# EAGLE design pm2016 (EAGLE 6.0)
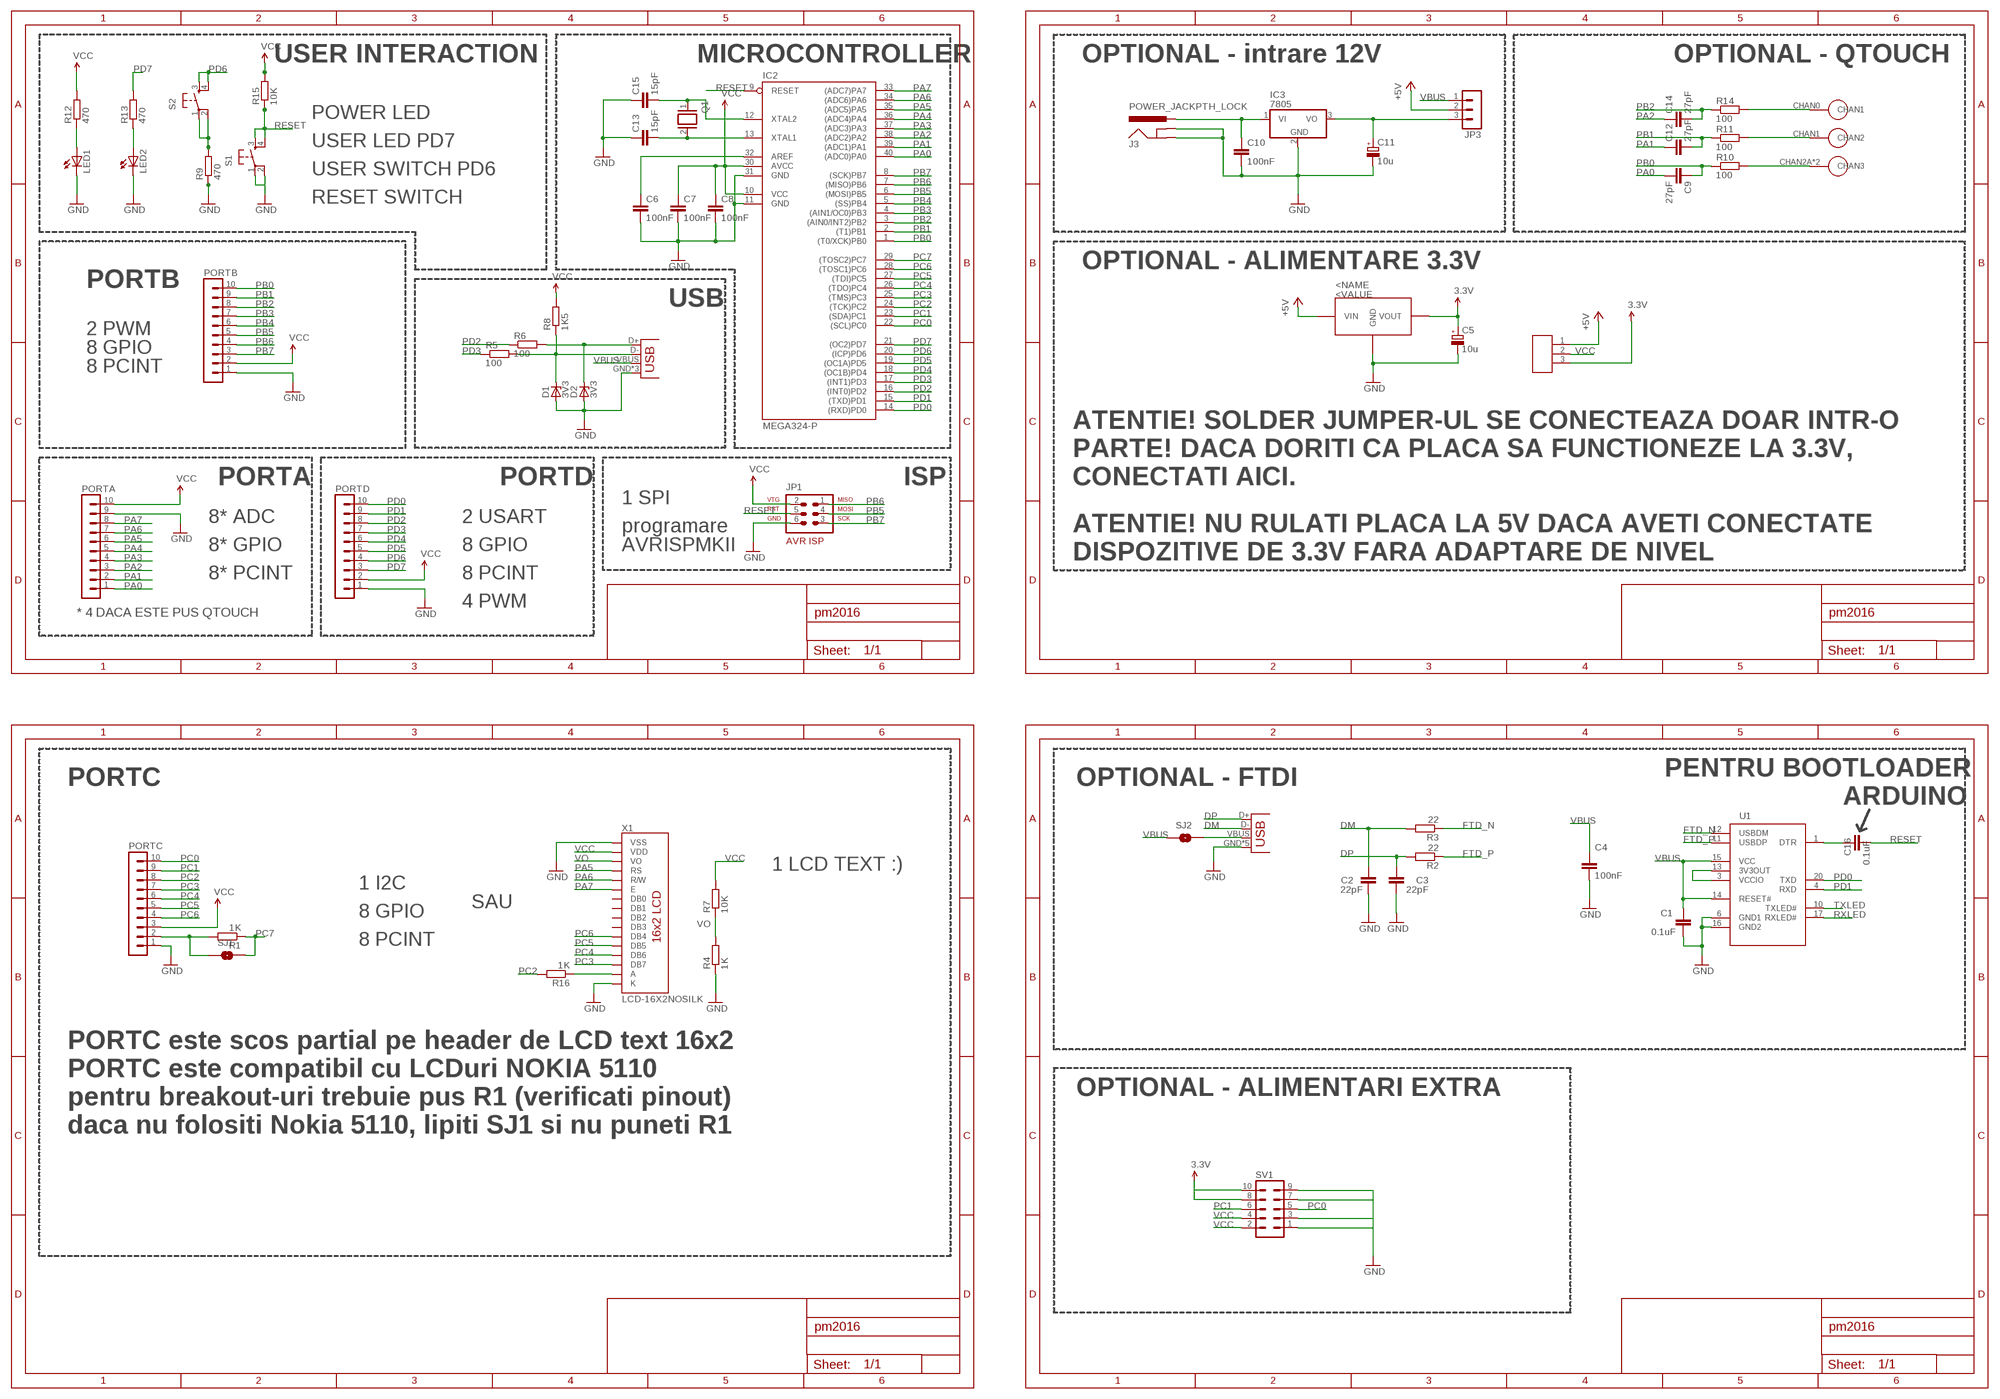
[diagram p0: schematic, sheet 1]

## Parts
C1  0.1uF  C-EUC0603  [C0603]
C2  22pF  C-EUC0603  [C0603]
C3  22pF  C-EUC0603  [C0603]
C4  100nF  C-EUC0603  [C0603]
C5  10u  CPOL-EUE2.5-5  [E2,5-5]
C6  100nF  C-EUC_PM  [C025-025X050]
C7  100nF  C-EUC_PM  [C025-025X050]
C8  100nF  C-EUC_PM  [C025-025X050]
C9  27pF  C-EUC1206  [C1206]
C10  100nF  C-EU025-025X050  [C025-025X050@1]
C11  10u  CPOL-EUE2.5-5  [E2,5-5]
C12  27pF  C-EUC1206  [C1206]
C13  15pF  C-EUC_PM  [C025-025X050]
C14  27pF  C-EUC1206  [C1206]
C15  15pF  C-EUC_PM  [C025-025X050]
C16  0.1uF  C-EUC0603  [C0603]
D1  3V3  ZENER-DIODEDO34-7  [DO34Z7]
D2  3V3  ZENER-DIODEDO34-7  [DO34Z7]
IC1  LE33  [TO92]
IC2  MEGA324-P  MEGA16-P  [DIL40]
IC3  7805  7805TNH  [TO22H_NOHOLE]
J1  USB  [ZX62D-B-5PA8]
J2  USBPTH  [USB-B-PTH]
J3  POWER_JACKPTH_LOCK  [POWER_JACK_PTH_LOCK]
JP1  AVR-ISP-6  [AVR-ISP-6]
JP2  SJUMPER  [SJUMPER_PACK]
JP3  MA03-1  [MA03-1]
LED1  LED5MM  [LED5MM]
LED2  LED5MM  [LED5MM]
PORTA  MA10-1  [MA10-1]
PORTB  MA10-1  [MA10-1]
PORTC  MA10-1  [MA10-1]
PORTD  MA10-1  [MA10-1]
Q1  XTAL/S  [QS]
R1  1K  R-EU_0204/7  [0204/7]
R2  22  R-EU_R0603  [R0603]
R3  22  R-EU_R0603  [R0603]
R4  1K  R-EU_0204/7  [0204/7]
R5  100  R-EU_0204/7  [0204/7]
R6  100  R-EU_0204/7  [0204/7]
R7  10K  R-EU_0204/7  [0204/7]
R8  1K5  R-EU_0204/7  [0204/7]
R9  470  R-EU_0204/7  [0204/7]
R10  100  R-EU_M1206  [M1206]
R11  100  R-EU_M1206  [M1206]
R12  470  R-EU_0204/7  [0204/7]
R13  470  R-EU_0204/7  [0204/7]
R14  100  R-EU_M1206  [M1206]
R15  10K  R-EU_0204/7  [0204/7]
R16  1K  R-EU_0204/7  [0204/7]
S1  TAC_SWITCHPTH  [TACTILE-PTH]
S2  TAC_SWITCHPTH  [TACTILE-PTH]
SJ1  SOLDERJUMPERNC  [SJ-NC]
SJ2  SOLDERJUMPERNC  [SJ-NC]
SV1  MA05-2  [MA05-2]
U1  FT231XS  [SSOP20]
U$1  QT_SLIDER  [QT_SLIDER]
X1  LCD-16X2NOSILK  [LCD-16X2_NOSILK]

## Nets
3.3V: C5.+ IC1.1(VOUT) JP2.3 SV1.8 SV1.10
+5V: IC1.3(VIN) JP2.1 JP3.2
DM: C2.2 J1.D- R3.2
DP: C3.2 J1.D+ R2.2
FTD_N: R3.1 U1.12(USBDM)
FTD_P: R2.1 U1.11(USBDP)
GND: C1.2 C2.1 C3.1 C4.2 C5.- C6.2 C7.2 C8.2 C10.2 C11.- C13.1 C15.1 D1.A D2.A IC1.2(GND) IC2.11(GND) IC2.31(GND) IC3.2(GND) J1.GND J1.P$8(GND) J1.P$9(GND) J1.P$10(GND) J1.P$11(GND) J2.GND J2.P$1(GND) J2.P$2(GND) J3.GND J3.GNDBREAK JP1.6 LED1.K(C) LED2.K(C) PORTA.9 PORTB.1 PORTC.1 PORTD.1 R4.1 R9.1 S1.1 S1.2 SV1.1 SV1.3 SV1.7 SV1.9 U1.6(GND1) U1.16(GND2) X1.1(VSS) X1.16(K)
N$1: LED2.A R13.1
N$2: LED1.A R12.1
N$3: PORTC.2 R1.2 SJ1.1
N$4: J1.VBUS SJ2.2
N$5: R14.2 U$1.CHAN0(CHAN1)
N$6: R11.2 U$1.CHAN1(CHAN2)
N$7: R10.2 U$1.CHAN2A(CHAN3) U$1.CHAN2B(CHAN3)
N$8: R16.1 X1.15(A)
N$9: C16.1 U1.1(DTR)
N$10: U1.3(VCCIO) U1.13(3V3OUT)
N$14: D2.C J2.D+ R6.2
N$15: D1.C J2.D- R5.2 R8.1
N$16: C10.1 IC3.1(VI) J3.PWR
N$17: R9.2 S2.1 S2.2
N$18: C11.+ IC3.3(VO) JP3.3
N$20: C6.1 IC2.32(AREF)
N$21: C13.2 IC2.13(XTAL1) Q1.2
N$22: C15.2 IC2.12(XTAL2) Q1.1
PA0: C9.2 IC2.40((ADC0)PA0) PORTA.1
PA1: C12.1 IC2.39((ADC1)PA1) PORTA.2
PA2: C14.1 IC2.38((ADC2)PA2) PORTA.3
PA3: IC2.37((ADC3)PA3) PORTA.4
PA4: IC2.36((ADC4)PA4) PORTA.5
PA5: IC2.35((ADC5)PA5) PORTA.6 X1.4(RS)
PA6: IC2.34((ADC6)PA6) PORTA.7 X1.5(R/W)
PA7: IC2.33((ADC7)PA7) PORTA.8 X1.6(E)
PB0: C9.1 IC2.1((T0/XCK)PB0) PORTB.10 R10.1
PB1: C12.2 IC2.2((T1)PB1) PORTB.9 R11.1
PB2: C14.2 IC2.3((AIN0/INT2)PB2) PORTB.8 R14.1
PB3: IC2.4((AIN1/OC0)PB3) PORTB.7
PB4: IC2.5((SS)PB4) PORTB.6
PB5: IC2.6((MOSI)PB5) JP1.4 PORTB.5
PB6: IC2.7((MISO)PB6) JP1.1 PORTB.4
PB7: IC2.8((SCK)PB7) JP1.3 PORTB.3
PC0: IC2.22((SCL)PC0) PORTC.10 SV1.5
PC1: IC2.23((SDA)PC1) PORTC.9 SV1.6
PC2: IC2.24((TCK)PC2) PORTC.8 R16.2
PC3: IC2.25((TMS)PC3) PORTC.7 X1.14(DB7)
PC4: IC2.26((TDO)PC4) PORTC.6 X1.13(DB6)
PC5: IC2.27((TDI)PC5) PORTC.5 X1.12(DB5)
PC6: IC2.28((TOSC1)PC6) PORTC.4 X1.11(DB4)
PC7: IC2.29((TOSC2)PC7) R1.1 SJ1.2
PD0: IC2.14((RXD)PD0) PORTD.10 U1.20(TXD)
PD1: IC2.15((TXD)PD1) PORTD.9 U1.4(RXD)
PD2: IC2.16((INT0)PD2) PORTD.8 R6.1
PD3: IC2.17((INT1)PD3) PORTD.7 R5.1
PD4: IC2.18((OC1B)PD4) PORTD.6
PD5: IC2.19((OC1A)PD5) PORTD.5
PD6: IC2.20((ICP)PD6) PORTD.4 S2.3 S2.4
PD7: IC2.21((OC2)PD7) PORTD.3 R13.2
RESET: C16.2 IC2.9(RESET) JP1.5 R15.1 S1.3 S1.4
RXLED: U1.17(RXLED#)
TXLED: U1.10(TXLED#)
VBUS: C1.1 C4.1 J2.VBUS JP3.1 SJ2.1 U1.14(RESET#) U1.15(VCC)
VCC: C7.1 C8.1 IC2.10(VCC) IC2.30(AVCC) JP1.2 JP2.2 PORTA.10 PORTB.2 PORTC.3 PORTD.2 R7.2 R8.2 R12.2 R15.2 SV1.2 SV1.4 X1.2(VDD)
VO: R4.2 R7.1 X1.3(VO)
Unconnected: X1.7(DB0) X1.8(DB1) X1.9(DB2) X1.10(DB3)

## Notes on the sheet
- USER INTERACTION | MICROCONTROLLER | OPTIONAL - intrare 12V | OPTIONAL - QTOUCH
- POWER LED
- USER LED PD7
- USER SWITCH PD6
- RESET SWITCH
- OPTIONAL - ALIMENTARE 3.3V
- PORTB
- USB
- 2 PWM
- 8 GPIO
- 8 PCINT
- ATENTIE! SOLDER JUMPER-UL SE CONECTEAZA DOAR INTR-O
- PARTE! DACA DORITI CA PLACA SA FUNCTIONEZE LA 3.3V,
- PORTA | PORTD | ISP | CONECTATI AICI.
- 1 SPI
- 8* ADC | 2 USART
- programare | ATENTIE! NU RULATI PLACA LA 5V DACA AVETI CONECTATE
- 8* GPIO | 8 GPIO | AVRISPMKII
- DISPOZITIVE DE 3.3V FARA ADAPTARE DE NIVEL
- 8* PCINT | 8 PCINT
- 4 PWM
- * 4 DACA ESTE PUS QTOUCH
- PENTRU BOOTLOADER
- PORTC | OPTIONAL - FTDI
- ARDUINO
- 1 LCD TEXT :)
- 1 I2C
- SAU
- 8 GPIO
- 8 PCINT
- PORTC este scos partial pe header de LCD text 16x2
- PORTC este compatibil cu LCDuri NOKIA 5110
- OPTIONAL - ALIMENTARI EXTRA
- pentru breakout-uri trebuie pus R1 (verificati pinout)
- daca nu folositi Nokia 5110, lipiti SJ1 si nu puneti R1

## Library data of the parts
C1-C4 C9 C10 C12 C14 C16 = resistor:C-EU: CAPACITOR, European symbol
C5 C11 = resistor:CPOL-EU: POLARIZED CAPACITOR, European symbol
C6-C8 C13 C15 = 0andrei_custom:C-EU: CAPACITOR, European symbol
D1 D2 = diode:ZENER-DIODE: Z-Diode
IC1 = 0andrei_custom:LE33
IC2 = atmel:MEGA16-P: MICROCONTROLLER 16 Kbytes FLASH 1 kbytes SRAM 512 bytes EEPROM USART 8-channel 10 bit ADC Source: avr.lbr; MPN: ATMEGA16-16PU; OC_FARNELL: 9171142; OC_NEWARK: 01M6885
IC3 = 0andrei_custom:78*: Positive VOLTAGE REGULATOR Source: http://cache.national.com/ds/LM/LM78L05.pdf http://www.fairchildsemi.com/ds/LM/LM7805.pdf
J1 J2 = 0andrei_custom:USB: USB Connectors USB-B-PTH is fully proven SKU : PRT-00139 USB-miniB is fully proven SKU : PRT-00587 USB-A-PCB is untested. USB-A-H is throughly reviewed, but untested. Spark Fun Electronics SKU : PRT-00437 USB-B-SMT is throughly reviewed, but untested. Needs silkscreen touching up. USB-A-S has not been used/tested USB-MB-H has not been used/tested
J3 = SparkFun-Connectors:POWER_JACK: Power Jack This is the standard 5.5mm barrel jack for power. The PTH is the most common, proven, reliable, footprint. The Slot footprint only works if the mill layer is transmitted to the PCB fab house so be warned. Spark Fun Electronics SKU : PRT-00119 SMT: CONN-08106 Mating wall wart : TOL-00298 (and others)
JP1 = 0andrei_custom:AVR-ISP-6: AVR ISP-6 Serial Programming Header
JP2 = 0andrei_custom:SJUMPER
JP3 = con-lstb:MA03-1: PIN HEADER; OC_FARNELL: unknown; OC_NEWARK: unknown
LED1 LED2 = led:LED: LED OSRAM: - CHIPLED LG R971, LG N971, LY N971, LG Q971, LY Q971, LO R971, LY R971 LH N974, LH R974 LS Q976, LO Q976, LY Q976 LO Q996 - Hyper CHIPLED LW Q18S LB Q993, LB Q99A, LB R99A - SideLED LS A670, LO A670, LY A670, LG A670, LP A670 LB A673, LV A673, LT A673, LW A673 LH A674 LY A675 LS A676, LA A676, LO A676, LY A676, LW A676 LS A679, LY A679, LG A679 - Hyper Micro SIDELED® LS Y876, LA Y876, LO Y876, LY Y876 LT Y87S - SmartLED LW L88C, LW L88S LB L89C, LB L89S, LG L890 LS L89K, LO L89K, LY L89K LS L896, LA L896, LO L896, LY L896 - TOPLED LS T670, LO T670, LY T670, LG T670, LP T670 LSG T670, LSP T670, LSY T670, LOP T670, LYG T670 LG T671, LOG T671, LSG T671 LB T673, LV T673, LT T673, LW T673 LH T674 LS T676, LA T676, LO T676, LY T676, LB T676, LH T676, LSB T676, LW T676 LB T67C, LV T67C, LT T67C, LS T67K, LO T67K, LY T67K, LW E67C LS E67B, LA E67B, LO E67B, LY E67B, LB E67C, LV E67C, LT E67C LW T67C LS T679, LY T679, LG T679 LS T770, LO T770, LY T770, LG T770, LP T770 LB T773, LV T773, LT T773, LW T773 LH T774 LS E675, LA E675, LY E675, LS T675 LS T776, LA T776, LO T776, LY T776, LB T776 LHGB T686 LT T68C, LB T68C - Hyper Mini TOPLED® LB M676 - Mini TOPLED Santana® LG M470 LS M47K, LO M47K, LY M47K Source: http://www.osram.convergy.de LUXEON: - LUMILED® LXK2-PW12-R00, LXK2-PW12-S00, LXK2-PW14-U00, LXK2-PW14-V00 LXK2-PM12-R00, LXK2-PM12-S00, LXK2-PM14-U00 LXK2-PE12-Q00, LXK2-PE12-R00, LXK2-PE12-S00, LXK2-PE14-T00, LXK2-PE14-U00 LXK2-PB12-K00, LXK2-PB12-L00, LXK2-PB12-M00, LXK2-PB14-N00, LXK2-PB14-P00, LXK2-PB14-Q00 LXK2-PR12-L00, LXK2-PR12-M00, LXK2-PR14-Q00, LXK2-PR14-R00 LXK2-PD12-Q00, LXK2-PD12-R00, LXK2-PD12-S00 LXK2-PH12-R00, LXK2-PH12-S00 LXK2-PL12-P00, LXK2-PL12-Q00, LXK2-PL12-R00 Source: www.luxeon.com KINGBRIGHT: KA-3528ASYC Source: www.kingbright.com
PORTA PORTB PORTC PORTD = con-lstb:MA10-1: PIN HEADER; OC_FARNELL: unknown; OC_NEWARK: unknown
Q1 = special:XTAL/S: CRYSTAL
R1 R4-R9 R12 R13 R15 R16 = 0andrei_custom:R-EU_: RESISTOR, European symbol
R2 R3 R10 R11 R14 = resistor:R-EU_: RESISTOR, European symbol
S1 S2 = SparkFun:TAC_SWITCH: Momentary Switch Button commonly used for reset or general input. Spark Fun Electronics SKU : COM-00097
SJ1 SJ2 = SparkFun-3-2-07:SOLDERJUMPER: Solder Jumper Standard SMD solder jumper. Used to automate production. Two varients : Normally Open and Normally Closed are the same, but have different paste layers. NC will have a large amount of paste and should jumper during reflow.
SV1 = con-lstb:MA05-2: PIN HEADER; OC_FARNELL: unknown; OC_NEWARK: unknown
U1 = 0andrei_custom:FT231XS
U$1 = 0andrei_custom:QT_SLIDER
X1 = 0andrei_custom:LCD-16X2: Standard text-only 16x2 parallel input LCD

## Net classes
1 power: width 0.61 mm

## Board
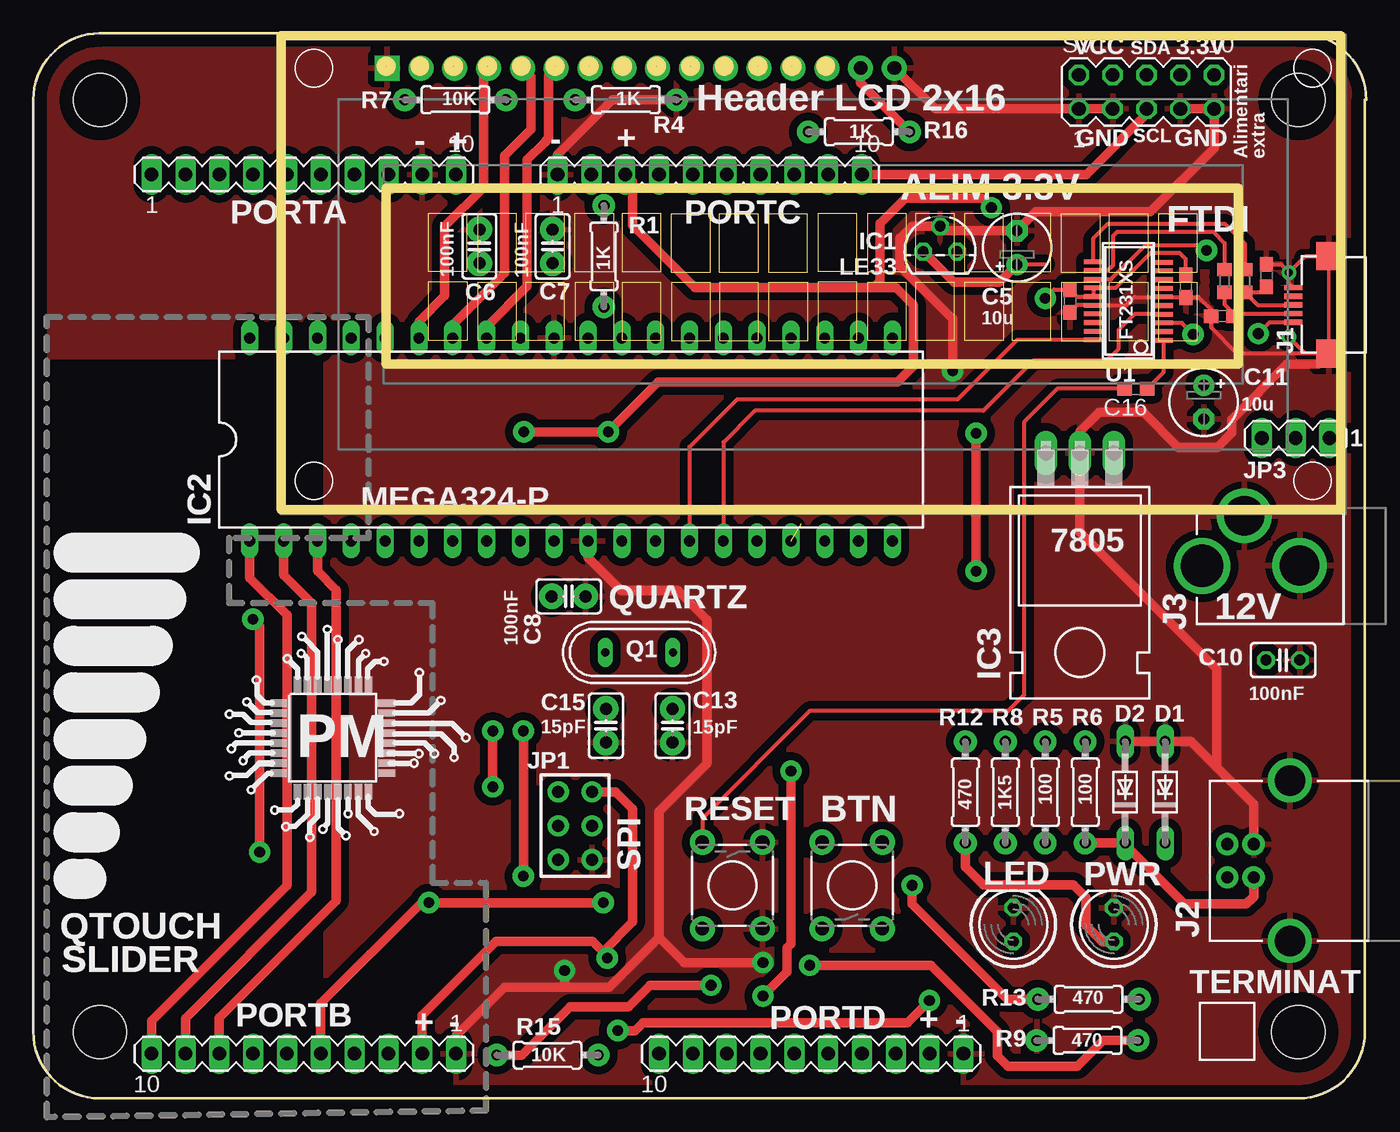
[diagram p1: board, top side]
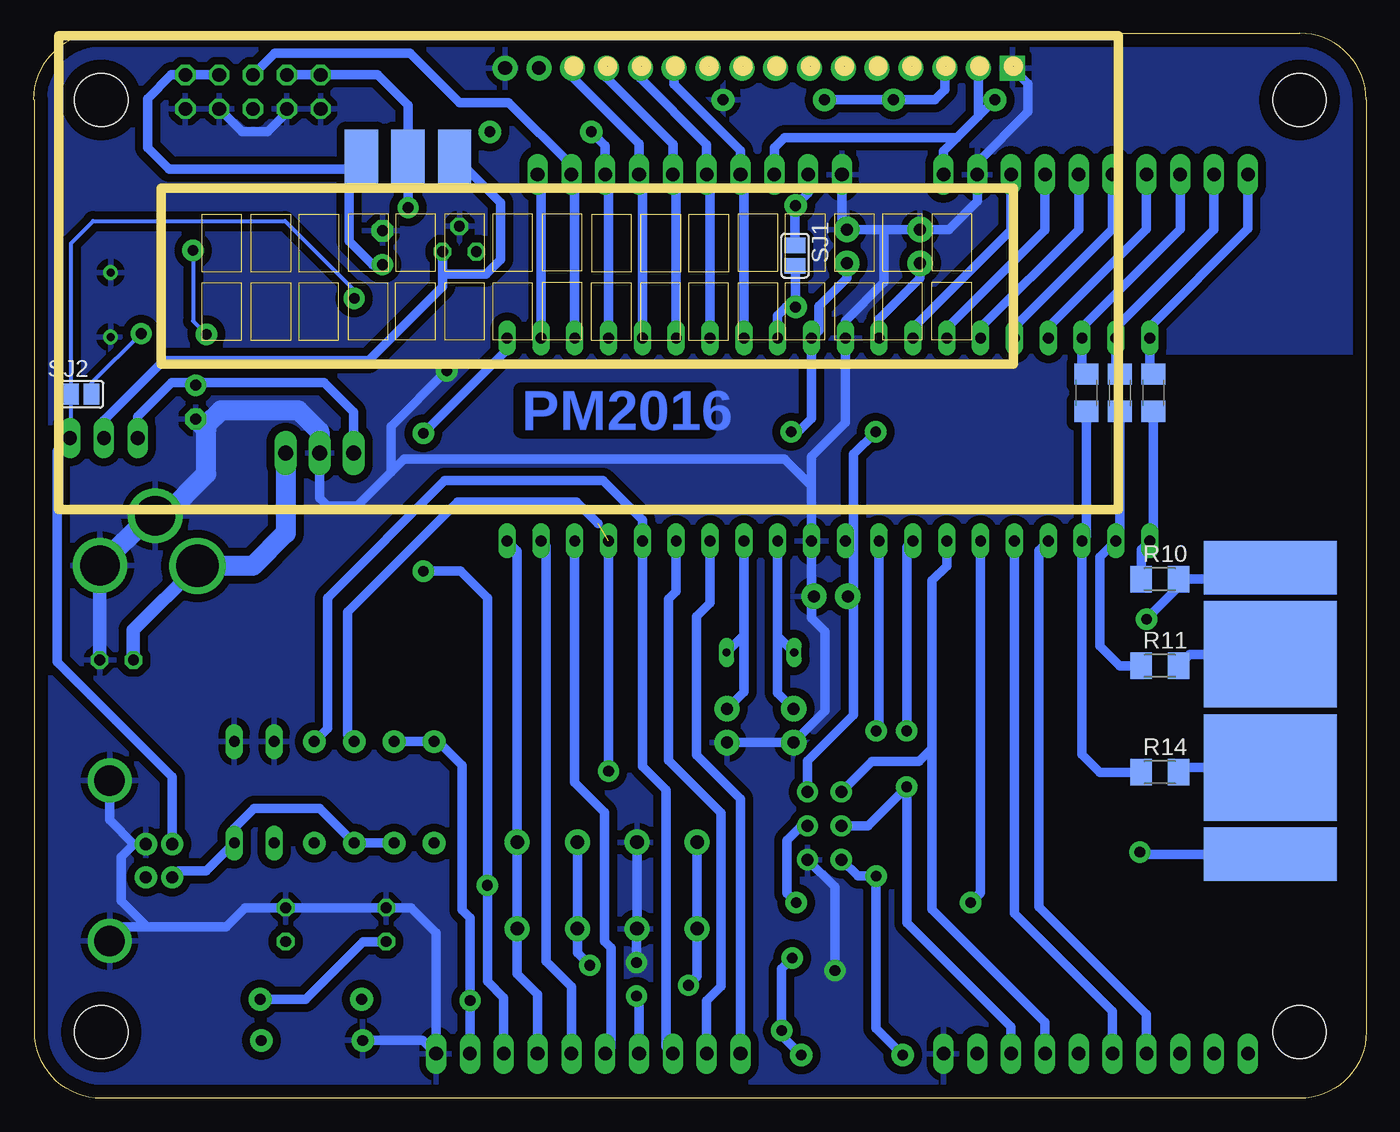
[diagram p2: board, bottom side, seen from below]

Size 100.1 x 80 mm. Coordinates in mm from the lower left corner, seen from the top.
Outline: 100,75 100,5 arc-90 95,0 5,0 arc-90 0,5 0,75 arc-90 5,80 95,80
Outline: 95.1,80 arc-90 100.1,75
Copper layers (1*16): Top 0.035mm / dielectric 1.5mm / Bottom 0.035mm
Design rules: minimum track width 10mil, minimum drill 0.6mm, track to track 0.3mm, track to pad 0.3mm, pad to pad 0.3mm, via to via 0.3mm, smd to smd 0mil, copper to edge 40mil, drill to drill 10mil, minimum pad ring 10mil, minimum via ring 8mil, stop-mask expansion 0mil, vias tented up to drill 0mil, thermal gap 20mil
Holes 4 mm at 95,75 5,5 5,75 95,5
Milling: area 26.1,77.2 to 26.9,77.9; area 28.7,77.2 to 29.4,77.9; area 31.2,77.2 to 31.9,77.9; area 33.8,77.2 to 34.5,77.9; area 36.3,77.2 to 37,77.9; area 38.8,77.2 to 39.6,77.9; area 41.4,77.2 to 42.1,77.9; area 43.9,77.2 to 44.6,77.9; area 46.5,77.2 to 47.2,77.9; area 49,77.2 to 49.7,77.9; area 51.5,77.2 to 52.3,77.9; area 54.1,77.2 to 54.8,77.9; 34 more areas; 8 lines

### Footprints (pad centres in the part's own frame; a part is rotated, then mirrored left to right if it is on the bottom)
C0603 = smd 1.1 x 1: 1 -0.85,0; 2 0.85,0
E2,5-5 = drill 0.813 pad 1.6: + -1.27,0 | drill 0.813 pad 1.6 octagon: - 1.27,0
C025-025X050 = drill 0.9 pad 1.9: 1 -1.27,0; 2 1.27,0
C1206 = smd 1.6 x 1.8: 1 -1.4,0; 2 1.4,0
C025-025X050@1 = drill 0.813 octagon: 1 -1.27,0; 2 1.27,0
DO34Z7 = drill 0.813 long: A 3.81,0; C -3.81,0
TO92 = drill 0.813 octagon: 1 -1.27,0; 2 0,1.905; 3 1.27,0
DIL40 = drill 0.813 long: 1 -24.13,-7.62; 2 -21.59,-7.62; 3 -19.05,-7.62; 4 -16.51,-7.62; 5 -13.97,-7.62; 6 -11.43,-7.62; 7 -8.89,-7.62; 8 -6.35,-7.62; 9 -3.81,-7.62; 10 -1.27,-7.62; 11 1.27,-7.62; 12 3.81,-7.62; 13 6.35,-7.62; 14 8.89,-7.62; 15 11.43,-7.62; 16 13.97,-7.62; 17 16.51,-7.62; 18 19.05,-7.62; 19 21.59,-7.62; 20 24.13,-7.62; 21 24.13,7.62; 22 21.59,7.62; 23 19.05,7.62; 24 16.51,7.62; 25 13.97,7.62; 26 11.43,7.62; 27 8.89,7.62; 28 6.35,7.62; 29 3.81,7.62; 30 1.27,7.62; 31 -1.27,7.62; 32 -3.81,7.62; 33 -6.35,7.62; 34 -8.89,7.62; 35 -11.43,7.62; 36 -13.97,7.62; 37 -16.51,7.62; 38 -19.05,7.62; 39 -21.59,7.62; 40 -24.13,7.62
TO22H_NOHOLE = drill 1.118 long: 1 -2.54,-10.16; 2 0,-10.16; 3 2.54,-10.16
ZX62D-B-5PA8 = smd 0.4 x 1.35: D+ 0,2.675; D- -0.65,2.675; GND 1.3,2.675; ID 0.65,2.675; VBUS -1.3,2.675 | drill 0.6: P$8 -2.425,3; P$9 2.425,3 | smd 2.1 x 1.9: P$10 -3.65,0; P$11 3.65,0
USB-B-PTH = drill 0.914 pad 1.676: D+ 0,1.25; D- 1.981,1.25; GND 0,-1.25; VBUS 1.981,-1.25 | drill 2.286: P$1 -2.718,-6.02; P$2 -2.718,6.02
POWER_JACK_PTH_LOCK = drill 2.997 pad 4.115: GND 0.025,6.557; GNDBREAK 3.762,10.7 | drill 3.2 pad 4.115: PWR 0,13.878
AVR-ISP-6 = drill 0.9 pad 1.6: 1 -2.54,-1.27; 2 -2.54,1.27; 3 0,-1.27; 4 0,1.27; 5 2.54,-1.27; 6 2.54,1.27
SJUMPER_PACK = smd 2.5 x 4: 1 -3.54,0; 2 -0.04,0; 3 3.46,0
MA03-1 = drill 1.016 long: 1 -2.54,0; 2 0,0; 3 2.54,0
LED5MM = drill 0.813 octagon: A -1.27,0; K 1.27,0
MA10-1 = drill 1.016 long: 1 -11.43,0; 2 -8.89,0; 3 -6.35,0; 4 -3.81,0; 5 -1.27,0; 6 1.27,0; 7 3.81,0; 8 6.35,0; 9 8.89,0; 10 11.43,0
QS = drill 0.61 long: 1 -2.54,0; 2 2.54,0
0204/7 = drill 0.813 pad 1.7: 1 -3.81,0; 2 3.81,0
R0603 = smd 1 x 1.1: 1 -0.85,0; 2 0.85,0
M1206 = smd 1.6 x 2: 1 -1.4,0; 2 1.4,0
TACTILE-PTH = drill 1.016 pad 1.88: 1 -3.251,2.261; 2 3.251,2.261; 3 -3.251,-2.261; 4 3.251,-2.261
SJ-NC = smd 1.168 x 1.6: 1 -0.762,0; 2 0.762,0
MA05-2 = drill 1.016 octagon: 1 -5.08,-1.27; 2 -5.08,1.27; 3 -2.54,-1.27; 4 -2.54,1.27; 5 0,-1.27; 6 0,1.27; 7 2.54,-1.27; 8 2.54,1.27; 9 5.08,-1.27; 10 5.08,1.27
SSOP20 = smd 0.348 x 1.397: 1 -2.955,-2.64; 2 -2.305,-2.64; 3 -1.655,-2.64; 4 -1.005,-2.64; 5 -0.355,-2.64; 6 0.295,-2.64; 7 0.945,-2.64; 8 1.595,-2.64; 9 2.245,-2.64; 10 2.895,-2.64; 11 2.925,2.64; 12 2.275,2.64; 13 1.625,2.64; 14 0.975,2.64; 15 0.325,2.64; 16 -0.325,2.64; 17 -0.975,2.64; 18 -1.625,2.64; 19 -2.275,2.64; 20 -2.925,2.64
QT_SLIDER = smd 8 x 10: CHAN0 -4.25,0; CHAN1 4.25,0 | smd 4 x 10: CHAN2A 10.75,0; CHAN2B -10.75,0
LCD-16X2_NOSILK = drill 1.016 pad 1.88 square: 1 -32,15.5 | drill 1.016 pad 1.88: 2 -29.46,15.5; 3 -26.92,15.5; 4 -24.38,15.5; 5 -21.84,15.5; 6 -19.3,15.5; 7 -16.76,15.5; 8 -14.22,15.5; 9 -11.68,15.5; 10 -9.14,15.5; 11 -6.6,15.5; 12 -4.06,15.5; 13 -1.52,15.5; 14 1.02,15.5; 15 3.56,15.5; 16 6.1,15.5

### Placement (x,y rotation side)
C1  77.85,59.9 270 top
C2  89.3,58.75 0 top
C3  92.6,61.8 270 top
C4  86.55,61 270 top
C5  73.88,63.9 90 top
C6  33.5,64 90 top
C7  39,64 90 top
C8  40.21,37.71 0 top
C9  16,53 90 bottom
C10  93.85,32.93 0 top
C11  87.9,52.3 270 top
C12  18.5,53 270 bottom
C13  48,28 90 top
C14  21,53 270 bottom
C15  43,28 90 top
C16  82.8,53.3 180 top
D1  85,23 90 top
D2  82,23 90 top
IC1  68.1,63.6 0 top
IC2  40.39,49.5 0 top
IC3  78.6,38.31 180 top
J1  97.3,59.6 90 top
J2  91.65,17.85 180 top
J3  101.65,40 90 top
JP1  40.69,20.48 270 top
JP2  72,70.75 180 bottom
JP3  94.8,49.6 180 top
LED1  81.15,13.05 90 top
LED2  73.6,13.05 90 top
PORTA  20.32,69.4 0 top
PORTB  20.32,3.36 180 top
PORTC  50.8,69.4 0 top
PORTD  58.42,3.36 180 top
Q1  45.5,33.5 0 top
R1  42.85,63.25 90 top
R2  91,61.4 270 top
R3  89.45,61.4 270 top
R4  44.5,75 180 top
R5  76,23 270 top
R6  79,23 270 top
R7  31.7,75 180 top
R8  73,23 90 top
R9  79.17,4.36 0 top
R10  15.5,39 0 bottom
R11  15.5,32.5 0 bottom
R12  70,23 90 top
R13  79.25,7.45 180 top
R14  15.5,24.5 0 bottom
R15  38.62,3.26 0 top
R16  62,72.6 180 top
S1  52.5,16 270 top
S2  61.5,16 90 top
SJ1  42.9,63.3 270 bottom
SJ2  96.5,52.9 0 bottom
SV1  83.6,75.6 0 top
U1  82.25,59.9 90 top
U$1  7.2,29.1 90 bottom
X1  58.57,61.89 0 top

### Tracks (layer width: path | path; a pad name or v marks a point on that pad's centre or on a via)
3.3V
  Top 0.3: 75.97,62.63 C5.+
  Top 0.7: IC1.1 69.13,61.3 72.55,61.3 C5.+
  Bottom 0.7: C5.+ 74.63,62.63 76.4,64.4 76.4,69.81 | 76.4,69.81 JP2.3 | SV1.8 SV1.10 89.73,76.87 91.5,75.1 91.5,71.4 89.91,69.81 76.4,69.81
+5V
  Bottom 0.7: JP3.2 94.8,50.9 90.3,55.4 74.93,55.4 69.37,60.96 69.37,62.1 | JP2.1 65,67.29 65,63 66.1,61.9 69.17,61.9 69.37,62.1 | 69.37,62.1 IC1.3
DM
  Top 0.3: R3.2 89.45,59.65 90.15,58.95 90.35,58.95 | 90.35,58.95 J1.D- | C2.2 90.35,58.95
DP
  Top 0.3: J1.D+ 91.95,59.6 R2.2 92.2,60.55 C3.2
FTD_N
  Top 0.3: U1.12 80.67,62.17 81.1,62.6 81.1,64.8 81.4,65.1 88.6,65.1 89.45,64.25 R3.1
FTD_P
  Top 0.3: U1.11 79.61,64.61 80.7,65.7 89.5,65.7 91,64.2 R2.1
GND  (via drill 0.8 pad 1.6)
  Top 0.254: J1.P$10 J1.P$11
  Top 0.3: 96.53,63.25 J1.P$11 95.53,63.25 J1.P$9 | J1.P$10 95.53,55.95 | 95.53,55.95 90.4,55.95 88.45,57.9 C2.1 88.45,59.25 87.5,60.19 86.55,60.19 | C3.1 93.67,62.65 J1.P$9 | J1.GND 94.3,61.22 J1.P$9 | J1.P$8 95.53,55.95 | C1.2 78.38,59.58 U1.16 82.08,59.58 82.69,60.19 U1.6 86.55,60.19 | 86.55,60.19 C4.2
  Top 0.7: J2.GND 91.65,22.1 88.88,24.88 | D2.A D1.A 86.94,26.81 88.88,24.88 | PORTB.1 31.75,4.7 35.4,8.35 40.2,8.35 | 40.2,8.35 43.25,8.35 47,12.1 | 47,12.1 47,21.55 50.6,25.15 50.6,35.95 48.4,38.15 44.15,38.15 41.66,40.64 IC2.11 | 88.88,24.88 88.88,32.27 78.6,42.55 IC3.2 78.6,50.1 80.05,51.55 83.35,51.55 86,48.9 88.9,48.9 90,50 90,51 94.15,55.15 96.5,55.15 J1.P$10 | v39.9,9.6 39.9,8.65 40.2,8.35 | PORTC.1 39.37,70.87 43.5,75 R4.1 | v69.05,54.65 69.05,58.55 65.1,62.5 65.1,64.6 66,65.5 IC1.2 68.44,65.17 C5.- 75.31,66.6 83.9,66.6 88.68,71.38 SV1.9 SV1.7 | SV1.3 SV1.1 67.73,74.33 X1.16 | v54.8,10.2 48.9,10.2 47,12.1
  Bottom 0.7: IC2.11 41.66,46 | 41.66,46 41.66,48.23 39.12,50.77 IC2.31 39.12,58.38 36.2,61.3 36.2,65.27 | 41.66,37.89 41.66,36.09 40.64,35.08 40.64,29.09 C15.1 C13.1 | 41.66,37.89 IC2.11 | 41.66,44.47 IC2.11 | 41.66,46 43.69,48.03 72.24,48.03 73.24,47.04 | C8.2 41.66,37.89 | 91.55,12.9 85.6,12.9 84.18,14.32 LED1.K LED2.K | 91.55,12.9 93.5,14.85 93.5,18.15 92.55,19.1 | 92.55,19.1 J2.GND | LED2.K 74.72,14.32 | v69.05,54.65 73.24,50.46 73.24,47.04 | 73.24,47.04 75.77,44.5 78,44.5 78.6,45.1 IC3.2 | 91.55,12.9 93.3,12.9 J2.P$2 | J2.P$1 94.37,20.92 92.55,19.1 | JP1.6 39.9,15.88 v39.9,9.6 | R9.1 70.85,4.36 PORTD.1 69.85,12.45 71.72,14.32 LED2.K | X1.1 25.4,76.22 25.4,74.1 29.21,70.29 PORTA.9 29.21,67.39 31.33,65.27 C6.2 36.2,65.27 | SV1.7 84.41,72.6 82.5,72.6 81.06,74.04 SV1.3 | 36.2,65.27 C7.2 39.37,65.64 PORTC.1 | v54.8,10.2 54.8,12.71 S1.2 S1.1
  Bottom 1: C10.2 95.12,40 J3.GND
  Bottom 1.5: 87.1,50.23 87.1,46.9 90.24,43.76 J3.GNDBREAK 91.36,43.76 J3.GND | 87.1,50.23 87.1,50.6 86,51.7 80.2,51.7 78.6,50.1 IC3.2 | C11.- 87.1,50.23
  pour Bottom (isolate 0.6): -2.15,79.63 100.94,79.63 100.94,-2.75 21.68,-2.75 21.68,44.84 21.68,56.05 7.04,56.05 -2.1,56.05 -2.1,79.6
  pour Top (isolate 0.6): -1.8,80.8 101.3,80.8 101.3,0.1 22,0.1 22,55.7 -1.8,55.7
N$1
  Bottom 0.7: R13.1 79.65,7.45 75.32,11.78 LED2.A
N$2
  Top 0.7: LED1.A 80.27,11.78 79.05,13 79.05,15.1 78.1,16.05 71.35,16.05 70,17.4 R12.1
N$3
  Bottom 0.7: PORTC.2 41.91,68 R1.2 42.9,67.01 SJ1.1
N$4  (via drill 0.8 pad 1.6)
  Top 0.3: v92,57.45 92.85,58.3 J1.VBUS
  Bottom 0.3: v92,57.45 95.74,53.71 SJ2.2
N$5
  Bottom 0.7: R14.2 13.75,24.85 U$1.CHAN0
N$6
  Bottom 0.7: R11.2 13.25,33.35 U$1.CHAN1
N$7  (via drill 0.8 pad 1.6)
  Top 0.7: v17,18.5 17,35.5 v16.5,36
  Bottom 0.7: U$1.CHAN2A 8.05,39 R10.2 14.1,38.4 v16.5,36 | U$1.CHAN2B 16.85,18.35 v17,18.5
N$8
  Top 0.7: X1.15 62.13,76.28 R16.1
N$9
  Top 0.3: C16.1 84.89,54.54 U1.1
N$10  (via drill 0.8 pad 1.6)
  Top 0.3: v88.1,63.7 87.7,64.1 83.5,64.1 80.92,61.53 U1.13 | v87.1,57.4 86.25,58.25 U1.3
  Bottom 0.3: v88.1,63.7 88.1,58.4 v87.1,57.4
N$14
  Top 0.7: J2.D+ 91.65,15.15 91.1,14.6 86.45,14.6 82.05,19 82,19 D2.C R6.2
N$15
  Bottom 0.7: J2.D- 89.19,17.08 87.11,17.08 D1.C 85,20.3 83.5,21.8 78.61,21.8 R5.2 R8.1
N$16
  Bottom 1: C10.1 92.58,35.19 J3.PWR
  Bottom 1.5: J3.PWR 83.6,40 81.14,42.46 IC3.1
N$17  (via drill 0.8 pad 1.6)
  Top 0.7: v58.3,10 67.4,10 72.4,5 72.4,3.2 73.2,2.4 78.4,2.4 80.36,4.36 R9.2
  Bottom 0.7: S2.2 S2.1 59.24,10.94 v58.3,10
N$18
  Bottom 0.7: 88.1,53.77 78.27,53.77 76.06,51.56 IC3.3 | C11.+ 88.1,53.77 | 88.1,53.77 89.69,53.77 92.26,51.2 JP3.3
N$20
  Bottom 0.7: IC2.32 36.58,58.52 33.5,61.6 C6.1
N$21
  Bottom 0.7: 46.74,34.8 46.74,30.53 C13.2 | IC2.13 46.74,35.5 46.74,34.8 | Q1.2 46.74,34.8
N$22
  Bottom 0.7: 44.2,34.74 44.2,30.47 C15.2 | IC2.12 44.2,35.5 44.2,34.74 | Q1.1 44.2,34.74
PA0
  Bottom 0.7: C9.2 16.26,54.66 IC2.40 16.26,57.94 8.89,65.31 PORTA.1
PA1
  Bottom 0.7: C12.1 18.8,54.7 IC2.39 18.8,57.9 11.43,65.27 PORTA.2
PA2
  Bottom 0.7: C14.1 21.34,54.74 IC2.38 21.34,57.91 13.97,65.28 PORTA.3
PA3
  Bottom 0.7: IC2.37 23.88,57.92 16.51,65.29 PORTA.4
PA4
  Bottom 0.7: IC2.36 26.42,57.93 19.05,65.3 PORTA.5
PA5
  Top 0.7: IC2.35 28.96,58.36 30.9,60.3 30.9,65.5 33.8,68.4 33.8,77 X1.4
  Bottom 0.7: IC2.35 28.96,57.89 21.59,65.26 PORTA.6
PA6
  Top 0.7: IC2.34 31.5,58.1 35.4,62 35.4,70.8 37.4,72.8 37.4,76.72 X1.5
  Bottom 0.7: IC2.34 31.5,57.85 24.13,65.22 PORTA.7
PA7
  Top 0.7: IC2.33 34.04,57.94 37.1,61 37.1,70.5 38.4,71.8 38.6,72 38.7,72.1 38.7,76.82 X1.6
  Bottom 0.7: IC2.33 34.04,57.86 26.67,65.23 PORTA.8
PB0
  Top 0.7: PORTB.10 8.89,5.84 19.05,16 19.05,36.3 16.26,39.09 IC2.1
  Bottom 0.7: R10.1 16.9,41.23 IC2.1 16,42.13 C9.1
PB1
  Top 0.7: PORTB.9 11.43,6.03 20.9,15.5 20.9,37.2 18.8,39.3 IC2.2
  Bottom 0.7: R11.1 18.5,32.5 20,34 20,40.67 IC2.2 18.5,42.17 C12.2
PB2
  Top 0.7: PORTB.8 13.97,6.07 22.75,14.85 22.75,38.2 21.34,39.61 IC2.3
  Bottom 0.7: R14.1 20,24.5 21.34,25.84 IC2.3 21,42.21 C14.2
PB3
  Bottom 0.7: PORTB.7 16.51,6.31 24.6,14.4 24.6,41.15 IC2.4
PB4
  Bottom 0.7: PORTB.6 19.05,6.55 26.42,13.92 IC2.5
PB5  (via drill 0.8 pad 1.6)
  Top 0.7: v42.8,14.7 v29.7,14.7 29.15,14.7 21.59,7.14 PORTB.5
  Bottom 0.7: JP1.4 42.42,20.48 43.5,19.4 43.5,15.4 v42.8,14.7 | IC2.6 28.96,15.44 v29.7,14.7
PB6
  Bottom 0.7: IC2.7 31.5,40 32.6,38.9 32.6,26.3 | 32.6,26.3 33.6,25.3 37.14,25.3 JP1.1 | PORTB.4 24.13,5.73 32.6,14.2 32.6,26.3
PB7  (via drill 0.8 pad 1.6)
  Top 0.7: v34.5,27.6 v34.5,23.4
  Bottom 0.7: IC2.8 34.5,41.41 v34.5,27.6 | JP1.3 37.42,20.48 v34.5,23.4 34.5,13.2 26.67,5.37 PORTB.3
PC0
  Top 0.7: PORTC.10 79.07,69.4 83.6,73.93 SV1.5
  Bottom 0.7: IC2.22 61.98,69.15 PORTC.10
PC1
  Bottom 0.7: IC2.23 59.44,69.15 PORTC.9 59.69,70.09 64.4,74.8 68.1,74.8 71.8,78.5 81.97,78.5 SV1.6
PC2
  Bottom 0.7: IC2.24 56.9,69.15 PORTC.8 57.15,71.56 R16.2
PC3
  Bottom 0.7: IC2.25 54.36,69.15 PORTC.7 54.61,71.71 59.59,76.69 X1.14
PC4
  Bottom 0.7: IC2.26 51.82,69.15 PORTC.6 52.07,71.67 57.05,76.65 X1.13
PC5
  Bottom 0.7: IC2.27 49.28,69.15 PORTC.5 49.53,71.63 54.51,76.61 X1.12
PC6
  Bottom 0.7: IC2.28 46.74,69.15 PORTC.4 46.99,71.19 51.97,76.17 X1.11
PC7
  Bottom 0.7: IC2.29 44.2,58.8 43.56,59.44 R1.1 42.85,62.49 SJ1.2
PD0
  Top 0.3: IC2.14 49.28,48.93 52.85,52.5 69.4,52.5 73.88,56.97 U1.20
  Bottom 0.7: IC2.14 49.28,37.22 50.3,36.2 50.3,25.8 46.99,22.49 PORTD.10
PD1
  Top 0.3: U1.4 82.69,58.89 81.5,57.7 81.5,56.3 80.6,55.4 75.1,55.4 71.35,51.65 54.2,51.65 51.82,49.27 IC2.15
  Bottom 0.7: IC2.15 51.82,38.08 52.4,37.5 52.4,25.38 48.45,21.43 48.45,8.41 49.53,7.33 PORTD.9
PD2
  Bottom 0.7: R6.1 78,27.81 78,37.59 69.19,46.4 57.3,46.4 54.36,43.46 IC2.16 54.36,24.95 52.6,23.19 52.6,3.89 PORTD.8
PD3  (via drill 0.8 pad 1.6)  (1 unrouted)
  Top 0.7: v56.9,24.58 56.9,11.6 56.6,11.3 56.6,9.5 v54.8,7.7
  Bottom 0.7: 57.7,43.2 59.3,44.8 68.25,44.8 76.5,36.55 76.5,27.31 R5.1 | v56.9,24.58 IC2.17 | v54.8,7.7 54.61,7.51 PORTD.7
PD4
  Bottom 0.7: IC2.18 59.44,23.74 57.2,21.5 57.2,11.8 56.7,11.3 56.7,3.81 PORTD.6
PD5
  Bottom 0.7: PORTD.5 59.69,8.39 61.6,10.3 61.6,41.5 IC2.19
PD6
  Bottom 0.7: PORTD.4 62.23,7.83 63.76,9.36 S2.3 S2.4 63.76,41.12 IC2.20
PD7  (via drill 0.8 pad 1.6)
  Top 0.7: v70.8,39.6 v70.8,49.97 | v66,16 66,14.6 73.15,7.45 R13.2
  Bottom 0.7: v70.8,49.97 64.52,56.25 IC2.21 | v70.8,39.6 68,39.6 66,37.6 v66,16 66,8.8 64.77,7.57 PORTD.3
RESET  (via drill 0.8 pad 1.6)
  Top 0.3: C16.2 76.9,53.3 74.4,50.8 74.4,30.3 73.2,29.1 58.3,29.1 50.24,21.04 S1.3
  Top 0.7: v36.8,27.6 v36.8,16.7 | R15.1 36.66,3.26 40.3,6.9 44.7,6.9 46.3,8.5 v50.9,8.5
  Bottom 0.7: IC2.9 36.58,27.88 36.8,27.65 v36.8,27.6 | JP1.5 38.18,16.7 v36.8,16.7 36.8,5.25 R15.1 | S1.3 S1.4 50.24,9.16 v50.9,8.5
VBUS  (via drill 0.8 pad 1.6)
  Top 0.3: C4.1 86.55,63.05 86.1,63.5 83.9,63.5 81.28,60.88 U1.14 U1.15 78.38,60.22 C1.1 76.65,60.75 v76,60.1
  Bottom 0.3: JP3.1 97.26,49.68 SJ2.1 97.26,64.24 95.6,65.9 81.2,65.9 76,60.7 v76,60.1
  Bottom 0.7: J2.VBUS 89.67,24.17 98.3,32.8 98.3,48.64 JP3.1
VCC  (via drill 0.8 pad 1.6)
  Top 0.7: v36.83,50.06 v43.18,50.06 46.92,53.8 64.9,53.8 66.1,55 66.1,59.6 64.8,60.9 63.1,60.9 | JP1.2 43.73,23.02 45,21.75 45,13.25 42.77,11.02 | PORTB.2 29.21,6.26 34.75,11.8 42,11.8 42.77,11.02 | 63.1,60.9 49.7,60.9 45,65.6 45,68.85 PORTC.3 | 42.77,11.02 42.77,10.88 v43.1,10.55 | v43.9,5.1 45.2,5.1 45.8,5.7 65.65,5.7 v67.3,7.35 | 63.1,60.9 63.6,61.4 63.6,65.7 65.5,67.6 71.25,67.6 v71.95,66.9
  Bottom 0.7: v36.83,50.06 38.5,48.39 38.5,42.49 | v43.18,50.06 42.67,50.06 41.66,51.08 IC2.30 41.1,57.67 41.1,59.5 39,61.6 C7.1 | 38.5,38.15 38.5,28.8 41.96,25.34 JP1.2 | 38.5,38.15 38.5,42.49 | IC2.10 38.5,42.49 | C8.1 38.5,38.15 | PORTD.2 v67.31,7.34 v67.3,7.35 67.3,13.55 67.9,14.15 67.9,25 69.71,26.81 R12.2 R8.2 | v43.1,10.55 43.9,9.75 v43.9,5.1 43.9,4.73 R15.2 | X1.2 29.11,73.79 | PORTC.3 44.45,71.4 43.7,72.15 30.75,72.15 | v71.95,66.9 v71.96,66.91 JP2.2 71.96,74.6 74.23,76.87 SV1.2 SV1.4 | 29.11,73.79 30.75,72.15 | 30.75,72.15 31.75,71.15 PORTA.10 | R7.2 29.11,73.79
VO
  Bottom 0.7: X1.3 31.65,75.75 32.4,75 R7.1 R4.2

### Text on the board
Bottom: PM2016
tPlace: VCC | SDA | 3.3V | Header LCD 2x16 | GND | SCL | GND | ALIM 3.3V | PORTA | PORTC | FTDI | QUARTZ | 12V | PM | RESET | BTN | SPI | LED | PWR | QTOUCH | SLIDER | TERMINAT | PORTB | PORTD
tNames: - | + | - | + | + | - | + | -
tDocu: Optional | alimentare 3.3V | Optional | alimentare 12V | Optional | QTouch
_tsilk: VCC | SDA | 3.3V | 10K | 1K | R7 | Header LCD 2x16 | R4 | 1K | R16 | GND | SCL | GND | - | + | - | + | Alimentari | extra | ALIM 3.3V | PORTA | PORTC | R1 | FTDI | IC1 | 100nF | 100nF | 1K | LE33 | C6 | C7 | C5 | 10u | FT231XS | J1 | U1 | C11 | 10u | 1 | JP3 | MEGA324-P | IC2 | 7805 | QUARTZ | 12V | J3 | 100nF | C8 | Q1 | C10 | IC3 | 100nF | C15 | C13 | R12 | R8 | R5 | R6 | D2 | D1 | 15pF | 15pF | PM | JP1 | 100 | 100 | 470 | 1K5 | RESET | BTN | SPI | LED | PWR | QTOUCH | QTOUCH | J2 | SLIDER | SLIDER | TERMINAT | R13 | 470 | PORTB | + | - | R15 | PORTD | + | - | R9 | 470 | 10K
215bmp: D:/Downloads/logo.bmp